# EAGLE design Hotkeys (EAGLE 7.2.0)
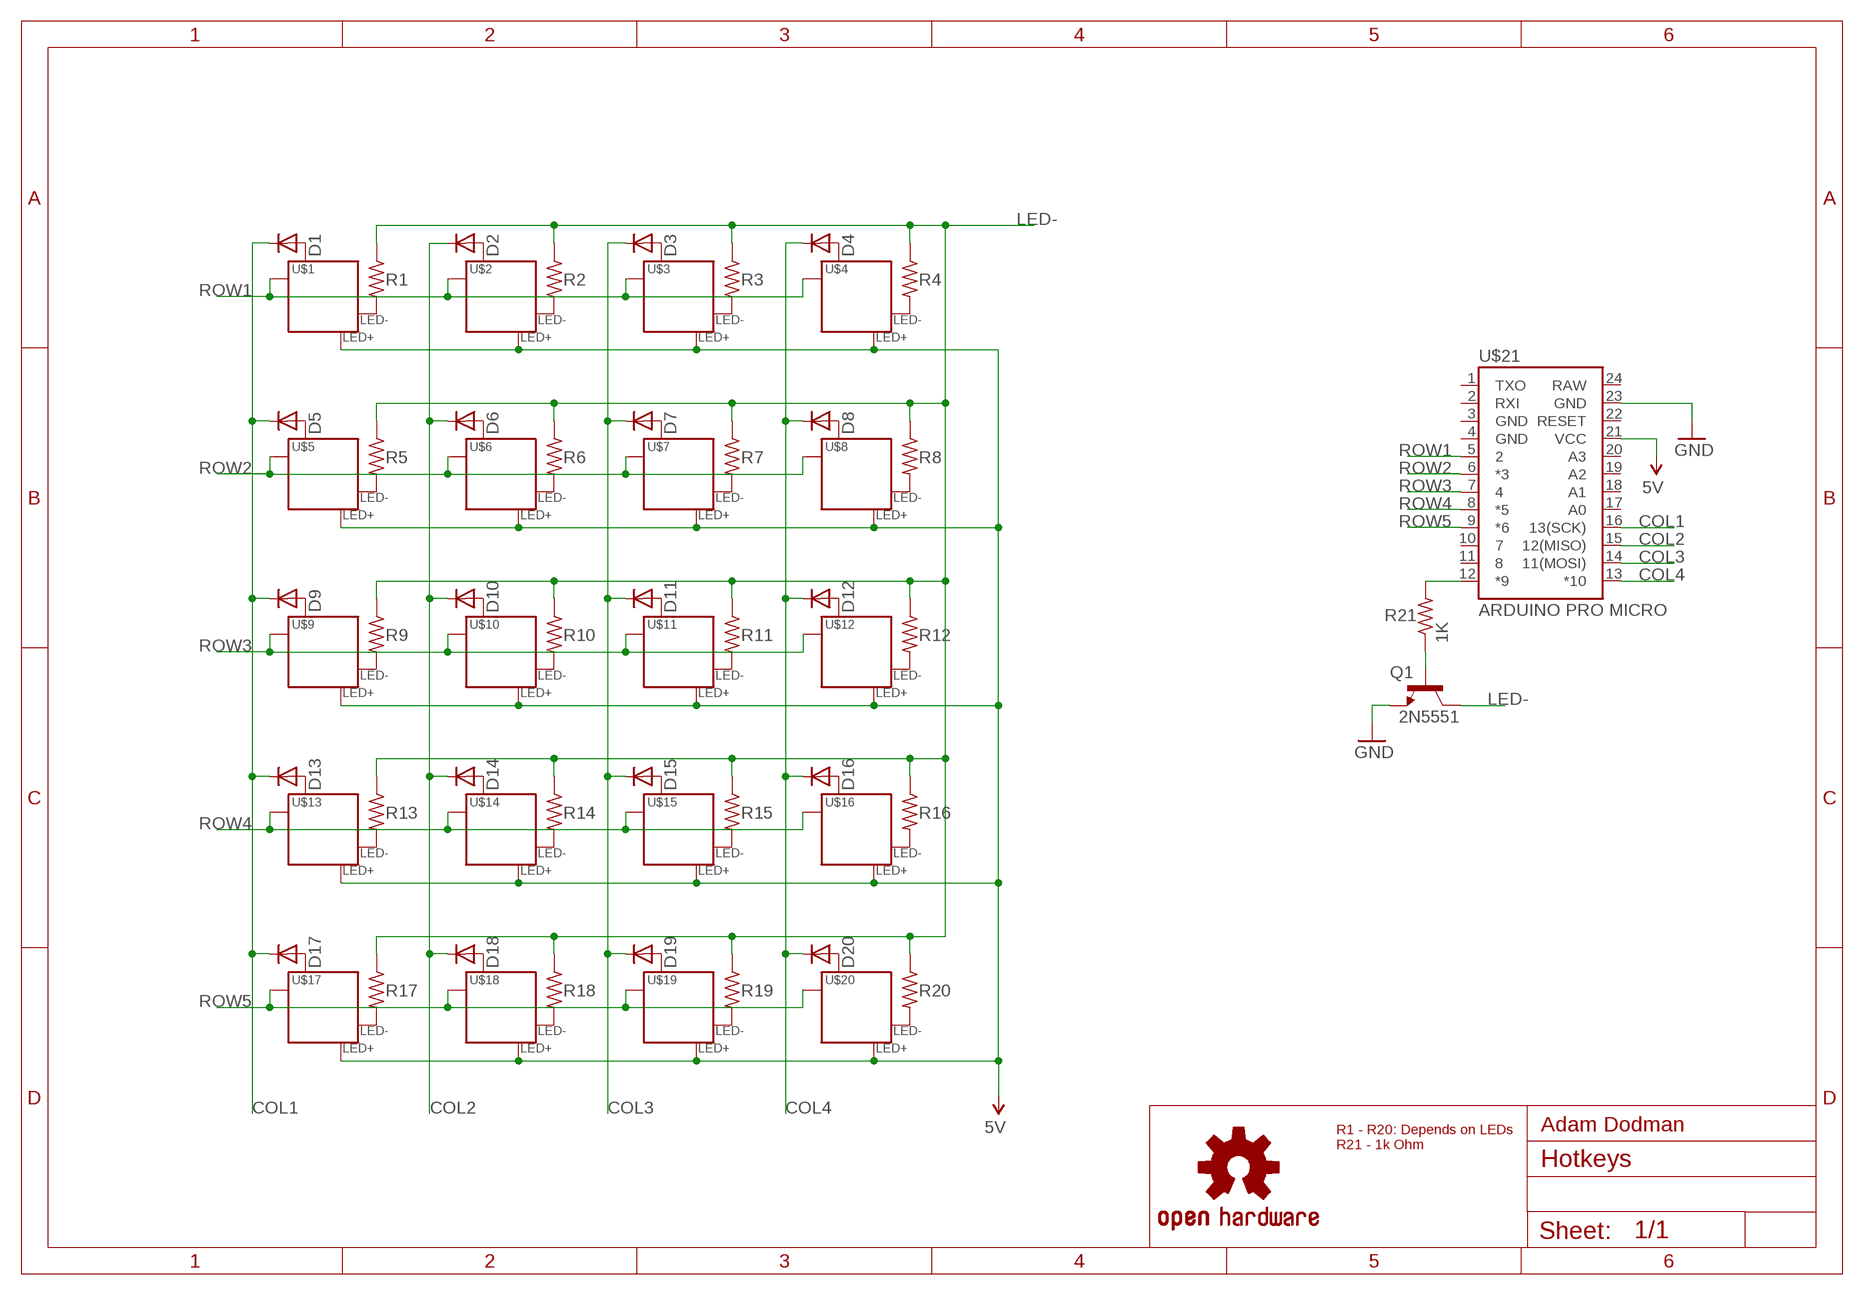
[diagram p0: schematic, sheet 1]

## Parts
D1  DIODE-DO41-7.6  [DO41-7.6]
D2  DIODE-DO41-7.6  [DO41-7.6]
D3  DIODE-DO41-7.6  [DO41-7.6]
D4  DIODE-DO41-7.6  [DO41-7.6]
D5  DIODE-DO41-7.6  [DO41-7.6]
D6  DIODE-DO41-7.6  [DO41-7.6]
D7  DIODE-DO41-7.6  [DO41-7.6]
D8  DIODE-DO41-7.6  [DO41-7.6]
D9  DIODE-DO41-7.6  [DO41-7.6]
D10  DIODE-DO41-7.6  [DO41-7.6]
D11  DIODE-DO41-7.6  [DO41-7.6]
D12  DIODE-DO41-7.6  [DO41-7.6]
D13  DIODE-DO41-7.6  [DO41-7.6]
D14  DIODE-DO41-7.6  [DO41-7.6]
D15  DIODE-DO41-7.6  [DO41-7.6]
D16  DIODE-DO41-7.6  [DO41-7.6]
D17  DIODE-DO41-7.6  [DO41-7.6]
D18  DIODE-DO41-7.6  [DO41-7.6]
D19  DIODE-DO41-7.6  [DO41-7.6]
D20  DIODE-DO41-7.6  [DO41-7.6]
LOGO1  OSHW-LOGOM  [OSHW-LOGO-M]
Q1  2N5551  TRANSISTOR_NPNBC547  [TO-92-AMMO]
R1  R-US_0207/7  [0207/7]
R2  R-US_0207/7  [0207/7]
R3  R-US_0207/7  [0207/7]
R4  R-US_0207/7  [0207/7]
R5  R-US_0207/7  [0207/7]
R6  R-US_0207/7  [0207/7]
R7  R-US_0207/7  [0207/7]
R8  R-US_0207/7  [0207/7]
R9  R-US_0207/7  [0207/7]
R10  R-US_0207/7  [0207/7]
R11  R-US_0207/7  [0207/7]
R12  R-US_0207/7  [0207/7]
R13  R-US_0207/7  [0207/7]
R14  R-US_0207/7  [0207/7]
R15  R-US_0207/7  [0207/7]
R16  R-US_0207/7  [0207/7]
R17  R-US_0207/7  [0207/7]
R18  R-US_0207/7  [0207/7]
R19  R-US_0207/7  [0207/7]
R20  R-US_0207/7  [0207/7]
R21  1K  R-US_0207/7  [0207/7]
U$1  MX-1U-LED  [P-MX-1U-LED]
U$2  MX-1U-LED  [P-MX-1U-LED]
U$3  MX-1U-LED  [P-MX-1U-LED]
U$4  MX-1U-LED  [P-MX-1U-LED]
U$5  MX-1U-LED  [P-MX-1U-LED]
U$6  MX-1U-LED  [P-MX-1U-LED]
U$7  MX-1U-LED  [P-MX-1U-LED]
U$8  MX-1U-LED  [P-MX-1U-LED]
U$9  MX-1U-LED  [P-MX-1U-LED]
U$10  MX-1U-LED  [P-MX-1U-LED]
U$11  MX-1U-LED  [P-MX-1U-LED]
U$12  MX-1U-LED  [P-MX-1U-LED]
U$13  MX-1U-LED  [P-MX-1U-LED]
U$14  MX-1U-LED  [P-MX-1U-LED]
U$15  MX-1U-LED  [P-MX-1U-LED]
U$16  MX-1U-LED  [P-MX-1U-LED]
U$17  MX-1U-LED  [P-MX-1U-LED]
U$18  MX-1U-LED  [P-MX-1U-LED]
U$19  MX-1U-LED  [P-MX-1U-LED]
U$20  MX-1U-LED  [P-MX-1U-LED]
U$21  ARDUINO PRO MICRO  ARDUINO_PRO_MICRO  [ARDUINO_PRO_MICRO]

## Nets
5V: U$1.LED+ U$2.LED+ U$3.LED+ U$4.LED+ U$5.LED+ U$6.LED+ U$7.LED+ U$8.LED+ U$9.LED+ U$10.LED+ U$11.LED+ U$12.LED+ U$13.LED+ U$14.LED+ U$15.LED+ U$16.LED+ U$17.LED+ U$18.LED+ U$19.LED+ U$20.LED+ U$21.21(VCC)
COL1: D1.C D5.C D9.C D13.C D17.C U$21.16(13(SCK))
COL2: D2.C D6.C D10.C D14.C D18.C U$21.15(12(MISO))
COL3: D3.C D7.C D11.C D15.C D19.C U$21.14(11(MOSI))
COL4: D4.C D8.C D12.C D16.C D20.C U$21.13(*10)
GND: Q1.3(E) U$21.23(GND)
LED-: Q1.1(C) R1.1 R2.1 R3.1 R4.1 R5.1 R6.1 R7.1 R8.1 R9.1 R10.1 R11.1 R12.1 R13.1 R14.1 R15.1 R16.1 R17.1 R18.1 R19.1 R20.1
N$1: D1.A U$1.MX2(P1)
N$2: D4.A U$4.MX2(P1)
N$3: D3.A U$3.MX2(P1)
N$4: R2.2 U$2.LED-
N$5: D5.A U$5.MX2(P1)
N$6: Q1.2(B) R21.1
N$7: R1.2 U$1.LED-
N$8: R3.2 U$3.LED-
N$9: R4.2 U$4.LED-
N$10: R21.2 U$21.12(*9)
N$11: D6.A U$6.MX2(P1)
N$12: D7.A U$7.MX2(P1)
N$13: D8.A U$8.MX2(P1)
N$14: D9.A U$9.MX2(P1)
N$15: D10.A U$10.MX2(P1)
N$16: D11.A U$11.MX2(P1)
N$17: R5.2 U$5.LED-
N$18: R6.2 U$6.LED-
N$19: R7.2 U$7.LED-
N$20: R8.2 U$8.LED-
N$21: D12.A U$12.MX2(P1)
N$22: D13.A U$13.MX2(P1)
N$23: D14.A U$14.MX2(P1)
N$24: D15.A U$15.MX2(P1)
N$25: D16.A U$16.MX2(P1)
N$26: D17.A U$17.MX2(P1)
N$27: D18.A U$18.MX2(P1)
N$28: R9.2 U$9.LED-
N$29: R10.2 U$10.LED-
N$30: R11.2 U$11.LED-
N$31: R12.2 U$12.LED-
N$32: D19.A U$19.MX2(P1)
N$33: D20.A U$20.MX2(P1)
N$34: D2.A U$2.MX2(P1)
N$39: R13.2 U$13.LED-
N$40: R14.2 U$14.LED-
N$41: R15.2 U$15.LED-
N$42: R16.2 U$16.LED-
N$50: R17.2 U$17.LED-
N$51: R18.2 U$18.LED-
N$52: R19.2 U$19.LED-
N$53: R20.2 U$20.LED-
ROW1: U$1.MX1(P0) U$2.MX1(P0) U$3.MX1(P0) U$4.MX1(P0) U$21.5
ROW2: U$5.MX1(P0) U$6.MX1(P0) U$7.MX1(P0) U$8.MX1(P0) U$21.6(*3)
ROW3: U$9.MX1(P0) U$10.MX1(P0) U$11.MX1(P0) U$12.MX1(P0) U$21.7
ROW4: U$13.MX1(P0) U$14.MX1(P0) U$15.MX1(P0) U$16.MX1(P0) U$21.8(*5)
ROW5: U$17.MX1(P0) U$18.MX1(P0) U$19.MX1(P0) U$20.MX1(P0) U$21.9(*6)
Unconnected: U$21.1(TXO) U$21.2(RXI) U$21.3(GND) U$21.4(GND) U$21.10 U$21.11 U$21.17(A0) U$21.18(A1) U$21.19(A2) U$21.20(A3) U$21.22(RESET) U$21.24(RAW)

## Notes on the sheet
- Adam Dodman
- R1 - R20: Depends on LEDs
  R21 - 1k Ohm

## Library data of the parts
D1-D20 = diode:DIODE-: DIODE
LOGO1 = SparkFun-Aesthetics:OSHW-LOGO: Open Source Hardware Logo This logo indicates the piece of hardware it is found on incorporates a OSHW license and/or adheres to the definition of open source hardware found here: http://freedomdefined.org/OSHW
Q1 = SparkFun-DiscreteSemi:TRANSISTOR_NPN: Generic NPN BJT MMBT2222A - TRANS-08049 (SOT-23, 1A 40V) MPSA42 - TRANS-09116 (SOT-23, 500mA 300V) MMBT5088LT1G - TRANS-11160 (SOT-23, 50 mA 30V) BC547 - COM-08928 <http://www.sparkfun.com/products/8928> (TO-92 45V 100mA) (1.Collector 2.Base 3.Emitter) 2N3904 - COM-00521 <http://www.sparkfun.com/products/521> (TO-92 40V 200mA) (1.Emitter 2.Base 3.Collector) P2N2222A - COM-12852 <http://www.sparkfun.com/products/12852> (TO-92 40V 600mA) (1.Collector 2.Base 3.Emitter)
R1-R21 = resistor:R-US_: RESISTOR, American symbol
U$1-U$20 = AlpsCherry:MX-1U-LED
U$21 = SparkFun-Boards:ARDUINO_PRO_MICRO

## Board
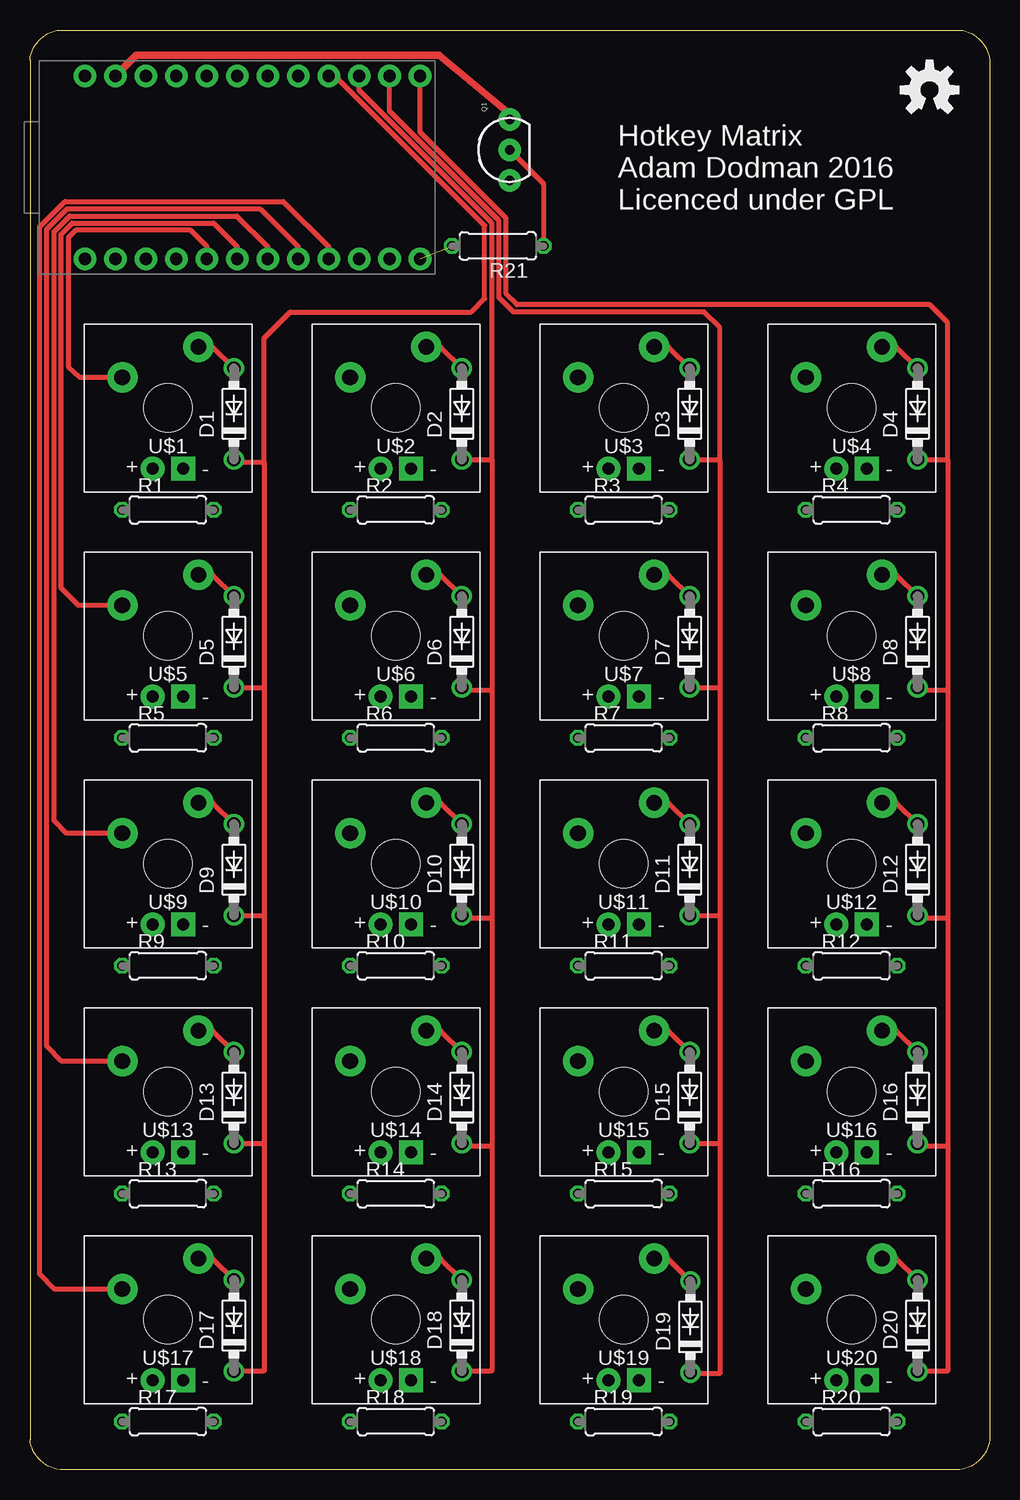
[diagram p1: board, top side]
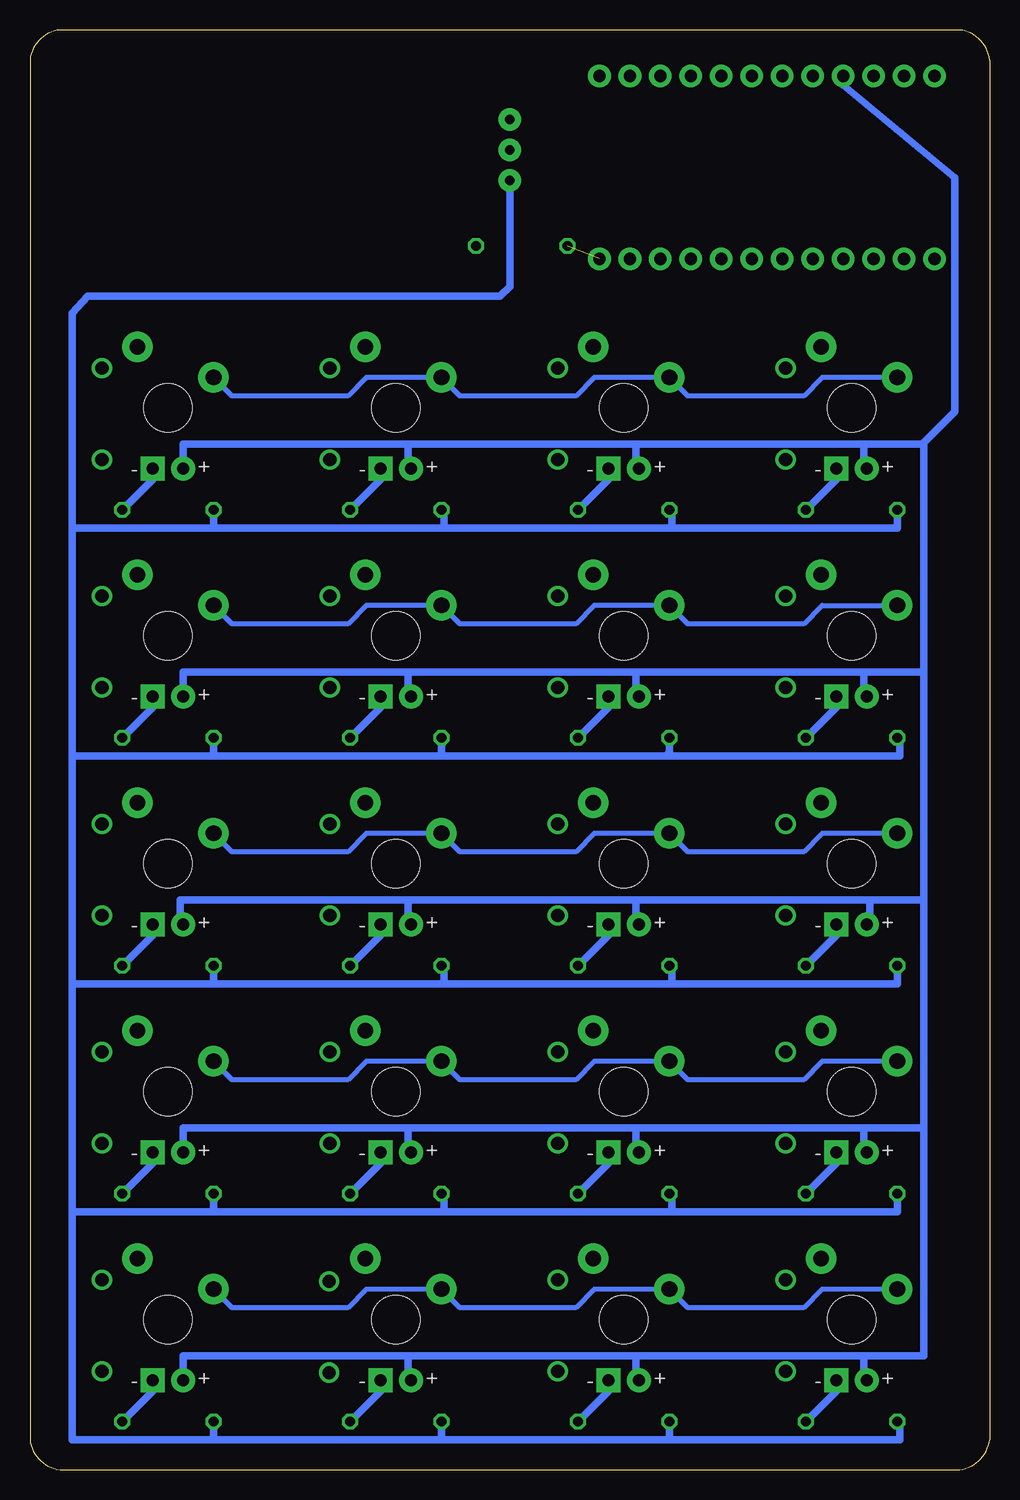
[diagram p2: board, bottom side, seen from below]

Size 80 x 120 mm. Coordinates in mm from the lower left corner, seen from the top.
Outline: 77.5,120 arc-80 80,117.5 80,2.5 arc-80 77.5,0 2.5,0 arc-80 0,2.5 0,117.5 arc-80 2.5,120 77.5,120
Copper layers (1*16): Top 0.035mm / dielectric 1.5mm / Bottom 0.035mm
Design rules "Elecrow_2-Layer": minimum track width 6mil, minimum drill 12mil, track to track 6mil, track to pad 6mil, pad to pad 6mil, via to via 6mil, smd to smd 0mil, copper to edge 10mil, drill to drill 10mil, minimum pad ring 10mil, minimum via ring 6mil, stop-mask expansion 2mil, vias tented up to drill 100mil, thermal gap 10mil

### Footprints (pad centres in the part's own frame; a part is rotated, then mirrored left to right if it is on the bottom)
DO41-7.6 = drill 1.1 pad 1.7: A 3.81,0; C -3.81,0
TO-92-AMMO = drill 0.813 pad 1.88: 1 -2.54,0; 2 0,0; 3 2.54,0
0207/7 = drill 0.813 octagon: 1 -3.81,0; 2 3.81,0
P-MX-1U-LED = drill 1 pad 2: LED+ -1.27,-5.08 | drill 1 pad 2 square: LED- 1.27,-5.08 | drill 1.3 pad 2.54: MX1 -3.81,2.54; MX2 2.54,5.08 | hole 4: 0,0
ARDUINO_PRO_MICRO = drill 1.016 pad 1.88: 1 -7.62,12.7; 2 -7.62,10.16; 3 -7.62,7.62; 4 -7.62,5.08; 5 -7.62,2.54; 6 -7.62,0; 7 -7.62,-2.54; 8 -7.62,-5.08; 9 -7.62,-7.62; 10 -7.62,-10.16; 11 -7.62,-12.7; 12 -7.62,-15.24; 13 7.62,-15.24; 14 7.62,-12.7; 15 7.62,-10.16; 16 7.62,-7.62; 17 7.62,-5.08; 18 7.62,-2.54; 19 7.62,0; 20 7.62,2.54; 21 7.62,5.08; 22 7.62,7.62; 23 7.62,10.16; 24 7.62,12.7

### Placement (x,y rotation side)
D1  17,88 90 top
D2  36,88 90 top
D3  55,88 90 top
D4  74,88 90 top
D5  17,69 90 top
D6  36,69 90 top
D7  55,69 90 top
D8  74,69 90 top
D9  17,50 90 top
D10  36,50 90 top
D11  55,50 90 top
D12  74,50 90 top
D13  17,31 90 top
D14  36,31 90 top
D15  55,31 90 top
D16  74,31 90 top
D17  17,12 90 top
D18  36,12 90 top
D19  55.06,11.88 90 top
D20  74,12 90 top
LOGO1  75,115 0 top
Q1  40,110 90 top
R1  11.5,80 0 top
R2  30.5,80 0 top
R3  49.5,80 0 top
R4  68.5,80 0 top
R5  11.5,61 0 top
R6  30.5,61 0 top
R7  49.5,61 0 top
R8  68.5,61 0 top
R9  11.5,42 0 top
R10  30.5,42 0 top
R11  49.5,42 0 top
R12  68.5,42 0 top
R13  11.5,23 0 top
R14  30.5,23 0 top
R15  49.5,23 0 top
R16  68.5,23 0 top
R17  11.5,4 0 top
R18  30.5,4 0 top
R19  49.5,4 0 top
R20  68.5,4 0 top
R21  39,102 180 top
U$1  11.5,88.5 0 top
U$2  30.5,88.5 0 top
U$3  49.5,88.5 0 top
U$4  68.5,88.5 0 top
U$5  11.5,69.5 0 top
U$6  30.5,69.5 0 top
U$7  49.5,69.5 0 top
U$8  68.5,69.5 0 top
U$9  11.5,50.5 0 top
U$10  30.5,50.5 0 top
U$11  49.5,50.5 0 top
U$12  68.5,50.5 0 top
U$13  11.5,31.5 0 top
U$14  30.5,31.5 0 top
U$15  49.5,31.5 0 top
U$16  68.5,31.5 0 top
U$17  11.5,12.5 0 top
U$18  30.5,12.5 0 top
U$19  49.5,12.5 0 top
U$20  68.5,12.5 0 top
U$21  17.28,108.54 90 top

### Tracks (layer width: path | path; a pad name or v marks a point on that pad's centre or on a via)
5V
  Bottom 0.61: U$9.LED+ 10,45.65 10,47.5 | 10,47.5 29.5,47.5 | 29.5,47.5 48.5,47.5 | 48.5,47.5 67.5,47.5 67.5,45.69 U$12.LED+ | U$10.LED+ 29.5,45.69 29.5,47.5 | U$11.LED+ 48.5,45.69 48.5,47.5 | U$13.LED+ 10.5,26.42 10.5,28.5 | 10.5,28.5 29.5,28.5 | 29.5,28.5 48.5,28.5 | 48.5,28.5 67.23,28.5 U$16.LED+ | U$15.LED+ 48.5,26.42 48.5,28.5 | U$14.LED+ 29.5,26.42 29.5,28.5 | U$1.LED+ 10.5,83.42 10.5,85.5 | 10.5,85.5 29.5,85.5 | 29.5,85.5 48.5,85.5 | 48.5,85.5 67.23,85.5 U$4.LED+ | U$3.LED+ 48.5,83.42 48.5,85.5 | U$2.LED+ 29.5,83.42 29.5,85.5 | U$5.LED+ 10.5,64.42 10.5,66.5 | 10.5,66.5 29.5,66.5 | 48.5,66.5 67.23,66.5 U$8.LED+ | U$7.LED+ 48.5,64.42 48.5,66.5 | U$6.LED+ 29.5,64.42 29.5,66.5 | U$17.LED+ 10.5,7.42 10.5,9.5 | 10.5,9.5 29.5,9.5 | 29.5,9.5 48.5,9.5 | 48.5,9.5 67.23,9.5 U$20.LED+ | U$19.LED+ 48.5,7.42 48.5,9.5 | U$18.LED+ 29.5,7.42 29.5,9.5 | 10.5,28.5 5.5,28.5 | 5.5,28.5 5.5,47.5 | 10.5,9.5 5.5,9.5 5.5,28.5 | 5.5,47.5 10,47.5 | 10.5,66.5 5.5,66.5 | 5.5,66.5 5.5,47.5 | 48.5,66.5 29.5,66.5 | 5.5,66.5 5.5,85.5 5.6,85.5 | 5.6,85.5 10.5,85.5 | 5.6,85.5 2.9,88.2 2.9,107.7 12.2,115.4 U$21.21
COL1
  Top 0.406: D1.C 17,84 19.5,84 | 19.5,84 19.5,65.19 | 19.5,65.19 19.5,46.19 | 19.5,46.19 19.5,27.19 | 19.5,27.19 19.5,8.19 D17.C | D13.C 19.5,27.19 | D9.C 19.5,46.19 | D5.C 19.5,65.19 | 19.5,84 19.5,94.3 21.7,96.5 36.8,96.5 37.9,97.6 37.9,103.7 25.44,116.16 U$21.16
COL2
  Top 0.406: D2.C 38.5,84.19 | 38.5,84.19 38.5,65 | 38.5,65 38.5,46 | 38.5,46 38.5,27 | 38.5,27 38.5,8.19 D18.C | D14.C 36,27 38.5,27 | D10.C 36,46 38.5,46 | D6.C 36,65 38.5,65 | 38.5,84.19 38.5,103.9 27.44,114.96 U$21.15
COL3
  Top 0.406: D3.C 57.5,84.19 | 57.5,84.19 57.5,65.19 | 57.5,65.19 57.5,46.19 | 57.5,46.19 57.5,27.19 | 57.5,27.19 57.5,8 55.06,8 D19.C | D15.C 57.5,27.19 | D11.C 57.5,46.19 | D7.C 57.5,65.19 | 57.5,84.19 57.5,95.2 56.2,96.5 40.3,96.5 39.1,97.7 39.1,104.1 29.98,113.22 U$21.14
COL4
  Top 0.406: D4.C 76.5,84.19 | 76.5,84.19 76.5,65 | 76.5,65 76.5,46 | 76.5,46 76.5,27 | 76.5,27 76.5,8.19 D20.C | D16.C 74,27 76.5,27 | D12.C 74,46 76.5,46 | D8.C 74,65 76.5,65 | 76.5,84.19 76.5,95.6 75,97.1 40.6,97.1 39.7,98 39.7,104.3 32.52,111.48 U$21.13
GND
  Top 0.61: Q1.3 40,113 34.1,117.9 8.86,117.9 U$21.23
LED-
  Bottom 0.61: R17.1 7.5,4 7.5,2.5 26.5,2.5 | 26.5,2.5 45.5,2.5 | 45.5,2.5 64.69,2.5 | 64.69,2.5 76.5,2.5 76.5,21.5 | R18.1 26.69,2.69 26.5,2.5 | R19.1 45.69,2.69 45.5,2.5 | R5.1 7.49,61.01 7.49,59.5 27,59.5 | 27,59.5 45.5,59.5 | 45.5,59.5 64.69,59.5 | 64.69,59.5 76.5,59.5 | R7.1 45.69,59.69 45.5,59.5 | R6.1 26.69,59.81 27,59.5 | 26.5,21.5 7.7,21.5 R13.1 | 26.5,21.5 45.5,21.5 | 45.5,21.5 64.7,21.5 | 64.7,21.5 76.5,21.5 | 26.5,40.5 7.69,40.5 R9.1 | 26.5,40.5 45.5,40.5 | 45.5,40.5 64.69,40.5 | 64.69,40.5 76.5,40.5 | R1.1 7.69,78.5 26.5,78.5 | 26.5,78.5 45.5,78.5 | R2.1 26.5,80 26.5,78.5 | R3.1 45.5,80 45.5,78.5 | R10.1 26.5,42 26.5,40.5 | R11.1 45.5,42 45.5,40.5 | R14.1 26.5,23 26.5,21.5 | R15.1 45.5,23 45.5,21.5 | 76.5,21.5 76.5,40.5 | 76.5,40.5 76.5,59.5 | 76.5,59.5 76.5,78.5 | 76.5,78.5 76.5,96.4 75.2,97.8 40.8,97.8 40,98.6 Q1.1 | 45.5,78.5 64.69,78.5 | 64.69,78.5 76.5,78.5 | R20.1 64.69,2.5 | R4.1 64.69,78.5 | R16.1 64.7,21.5 | R8.1 64.69,59.5 | R12.1 64.69,40.5
N$1
  Top 0.406: U$1.MX2 15.23,93.58 D1.A
N$2
  Top 0.406: U$4.MX2 72.23,93.58 D4.A
N$3
  Top 0.406: U$3.MX2 53.23,93.58 D3.A
N$4
  Bottom 0.61: U$2.LED- 31.77,82.54 R2.2
N$5
  Top 0.406: U$5.MX2 15.23,74.58 D5.A
N$6
  Top 0.406: Q1.2 42.81,107.19 R21.1
N$7
  Bottom 0.61: U$1.LED- 12.77,82.54 R1.2
N$8
  Bottom 0.61: U$3.LED- 50.77,82.54 R3.2
N$9
  Bottom 0.61: U$4.LED- 69.77,82.54 R4.2
N$10  (1 unrouted)
N$11
  Top 0.406: U$6.MX2 34.23,74.58 D6.A
N$12
  Top 0.406: U$7.MX2 53.23,74.58 D7.A
N$13
  Top 0.406: U$8.MX2 72.23,74.58 D8.A
N$14
  Top 0.406: U$9.MX2 15.23,55.58 D9.A
N$15
  Top 0.406: U$10.MX2 34.23,55.58 D10.A
N$16
  Top 0.406: U$11.MX2 53.23,55.58 D11.A
N$17
  Bottom 0.61: U$5.LED- 12.77,63.54 R5.2
N$18
  Bottom 0.61: U$6.LED- 31.77,63.54 R6.2
N$19
  Bottom 0.61: U$7.LED- 50.77,63.54 R7.2
N$20
  Bottom 0.61: U$8.LED- 69.77,63.54 R8.2
N$21
  Top 0.406: U$12.MX2 72.23,55.58 D12.A
N$22
  Top 0.406: U$13.MX2 15.23,36.58 D13.A
N$23
  Top 0.406: U$14.MX2 34.23,36.58 D14.A
N$24
  Top 0.406: U$15.MX2 53.23,36.58 D15.A
N$25
  Top 0.406: U$16.MX2 72.23,36.58 D16.A
N$26
  Top 0.406: U$17.MX2 15.23,17.58 D17.A
N$27
  Top 0.406: U$18.MX2 34.23,17.58 D18.A
N$28
  Bottom 0.61: U$9.LED- 12.77,44.54 R9.2
N$29
  Bottom 0.61: U$10.LED- 31.77,44.54 R10.2
N$30
  Bottom 0.61: U$11.LED- 50.77,44.54 R11.2
N$31
  Bottom 0.61: U$12.LED- 69.77,44.54 R12.2
N$32
  Top 0.406: U$19.MX2 53.17,17.58 D19.A
N$33
  Top 0.406: U$20.MX2 72.23,17.58 D20.A
N$34
  Top 0.406: U$2.MX2 34.23,93.58 D2.A
N$39
  Bottom 0.61: U$13.LED- 12.77,25.54 R13.2
N$40
  Bottom 0.61: U$14.LED- 31.77,25.54 R14.2
N$41
  Bottom 0.61: U$15.LED- 50.77,25.54 R15.2
N$42
  Bottom 0.61: U$16.LED- 69.77,25.54 R16.2
N$50
  Bottom 0.61: U$17.LED- 12.77,6.54 R17.2
N$51
  Bottom 0.61: U$18.LED- 31.77,6.54 R18.2
N$52
  Bottom 0.61: U$19.LED- 50.77,6.54 R19.2
N$53
  Bottom 0.61: U$20.LED- 69.77,6.54 R20.2
ROW1
  Top 0.406: U$1.MX1 4.16,91.04 3.2,91.9 3.2,102.7 3.8,103.3 13.4,103.3 14.74,101.96 U$21.5
  Bottom 0.406: U$1.MX1 13.96,91.04 15.5,89.5 25.15,89.5 U$2.MX1 32.96,91.04 34.5,89.5 44.15,89.5 U$3.MX1 51.96,91.04 53.5,89.5 63.15,89.5 U$4.MX1
ROW2
  Top 0.406: U$5.MX1 4.06,72.04 2.6,73.5 2.6,103 3.5,103.9 15.3,103.9 17.28,101.92 U$21.6
  Bottom 0.406: U$8.MX1 63.15,70.5 53.5,70.5 51.96,72.04 U$7.MX1 44.15,70.5 34.5,70.5 32.96,72.04 U$6.MX1 25.15,70.5 15.5,70.5 13.96,72.04 U$5.MX1
ROW3
  Top 0.406: U$9.MX1 3.06,53.04 2,54.1 2,103.2 3.3,104.5 17.24,104.5 19.82,101.92 U$21.7
  Bottom 0.406: U$9.MX1 13.96,53.04 15.5,51.5 25.15,51.5 U$10.MX1 32.96,53.04 34.5,51.5 44.15,51.5 U$11.MX1 51.96,53.04 53.5,51.5 63.15,51.5 U$12.MX1
ROW4
  Top 0.406: U$13.MX1 2.66,34.04 1.4,35.3 1.4,103.4 3.1,105.1 19.18,105.1 22.36,101.92 U$21.8
  Bottom 0.406: U$13.MX1 13.96,34.04 15.5,32.5 25.15,32.5 U$14.MX1 32.96,34.04 34.5,32.5 44.15,32.5 U$15.MX1 51.96,34.04 53.5,32.5 63.15,32.5 U$16.MX1
ROW5
  Top 0.406: U$17.MX1 2.06,15.04 0.8,16.3 0.8,103.6 2.9,105.7 21.12,105.7 24.9,101.92 U$21.9
  Bottom 0.406: U$17.MX1 13.96,15.04 15.5,13.5 25.15,13.5 U$18.MX1 32.96,15.04 34.5,13.5 44.15,13.5 U$19.MX1 51.96,15.04 53.5,13.5 63.15,13.5 U$20.MX1

### Text on the board
tPlace: Hotkey Matrix / Adam Dodman 2016 / Licenced under GPL